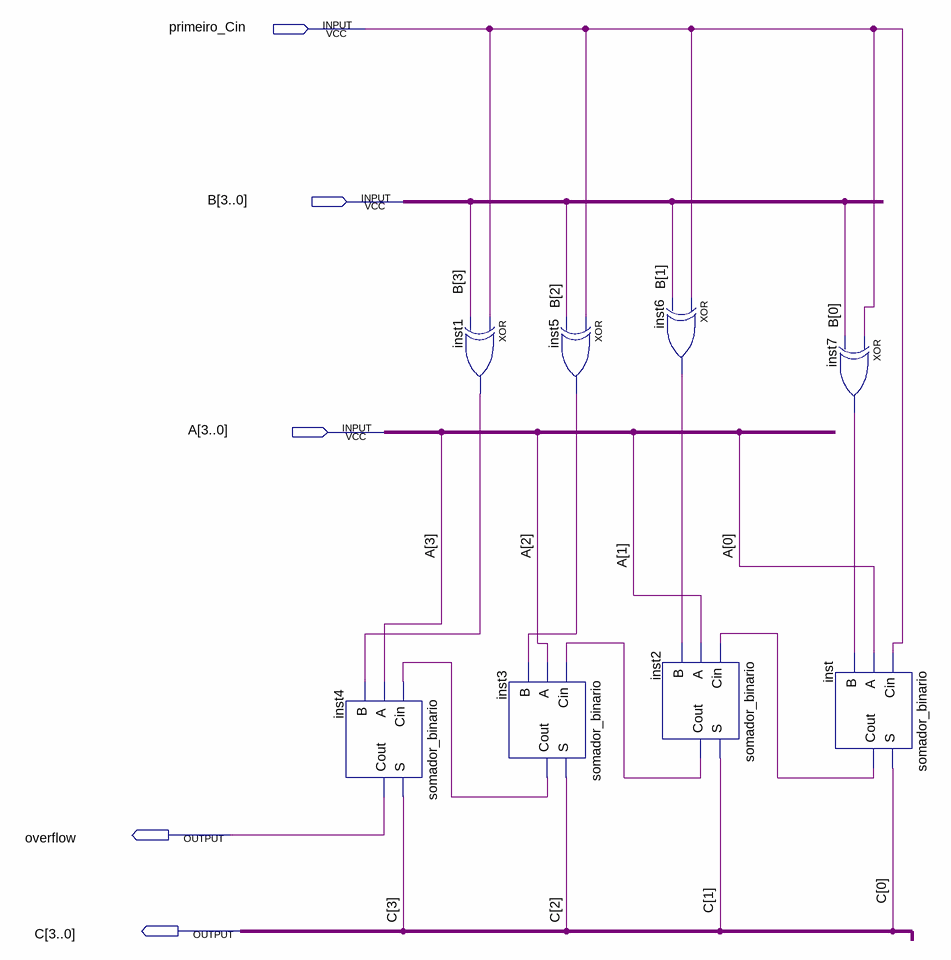
[diagram p0: schematic sheet]
// Quartus schematic somador_total.bdf as structural Verilog: 8 symbols, 5 pins
module somador_total (
  input  primeiro_Cin,
  input  [3:0] B,
  input  [3:0] A,
  output overflow,
  output [3:0] C
);

  wire inst1_out, inst2_cout, inst3_cout, inst5_out, inst6_out, inst7_out, inst_cout;

  somador_binario inst4 (.Cin(inst3_cout), .A(A[3]), .B(inst1_out), .S(C[3]), .Cout(overflow));
  xor inst1 (inst1_out, primeiro_Cin, B[3]);
  somador_binario inst3 (.Cin(inst2_cout), .A(A[2]), .B(inst5_out), .S(C[2]), .Cout(inst3_cout));
  xor inst5 (inst5_out, primeiro_Cin, B[2]);
  somador_binario inst2 (.Cin(inst_cout), .A(A[1]), .B(inst6_out), .S(C[1]), .Cout(inst2_cout));
  xor inst6 (inst6_out, primeiro_Cin, B[1]);
  xor inst7 (inst7_out, primeiro_Cin, B[0]);
  somador_binario inst (.Cin(primeiro_Cin), .A(A[0]), .B(inst7_out), .S(C[0]), .Cout(inst_cout));
endmodule
